# EasyEDA Pro project EasyEDA_sensor_project.epro

# Schematic Schematic1
Board Name: Board1; Create Date: 2025-11-02; Page Name: P1; Project Name: Sensor_Proyect; Schematic Name: Schematic1; Update Date: 2025-11-25; Company: EasyEDA.com; Page Size: A4; Version: V1.0
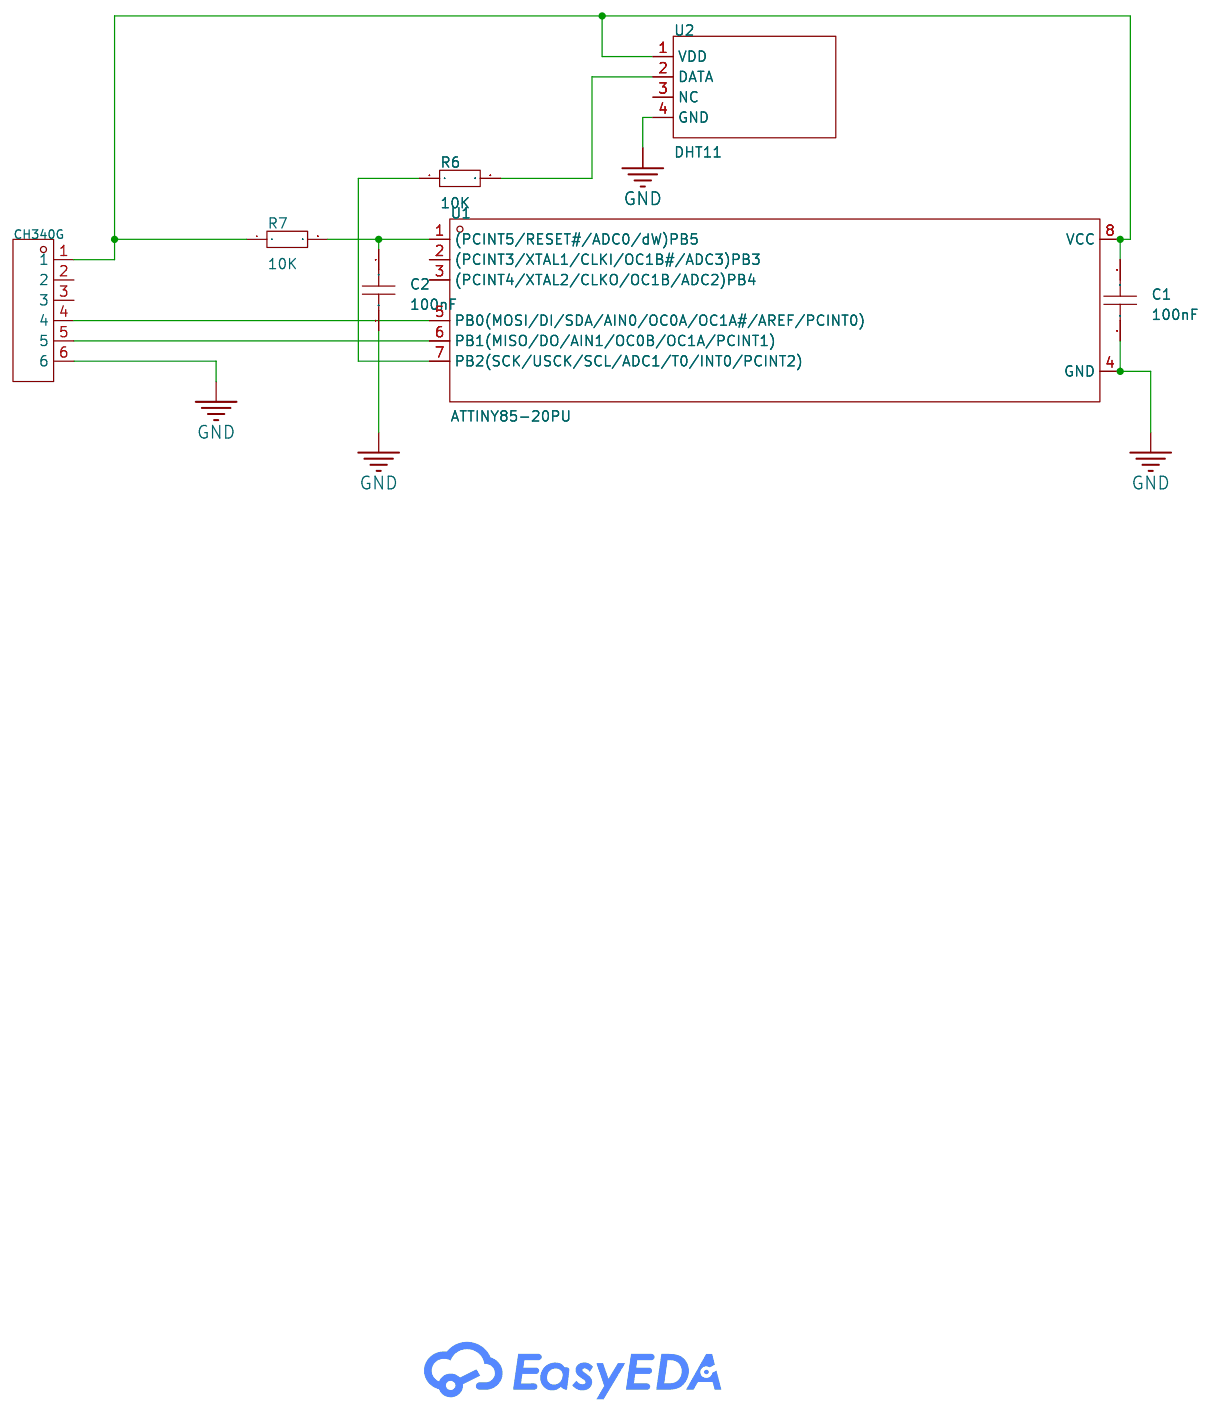
[diagram p0: schematic sheet]

## Parts
C1  100nF  [C0805]
C2  100nF  [C0805]
CH340G  -  [HDR-TH_6P-P2.54-V-F]
R6  10K  [RES-TH_BD1.6-L3.6-P7.60-D0.5]
R7  10K  [RES-TH_BD1.6-L3.6-P7.60-D0.5]
U1  ATTINY85-20PU  [PDIP-8_L9.3-W6.4-P2.54-LS7.9-BL-1]
U2  DHT11  [SENSOR-TH_DHT11]

## Library data of the parts
C1 C2 = CAP_0805: Supplier Footprint: 0805
CH340G = HDR-F_2.54_1x6P: Supplier Footprint: Through
R6 R7 = Res_0603: Supplier Footprint: 0603
U1 = ATTINY85-20PU: CPU Core:AVR CPU Maximum Speed:20MHz Program Storage Size:8KB Program Memory Type:FLASH EEPROM:512Byte Number of I/O:6 ADC (Bit):10bit Voltage - Supply:2.7V~5.5V Voltage - Supply:2.7V~5.5V Applications:-; Supplier Part: C965497; Manufacturer: MICROCHIP(美国微芯); Supplier Footprint: PDIP-8; JLCPCB Part Class: Extended Part; Datasheet: https://item.szlcsc.com/datasheet/ATTINY85-20PU/1052792.html; Supplier: LCSC; CPU Core: AVR; CPU Maximum Speed: 20MHz; Program Storage Size: 8KB; Program Memory Type: FLASH; EEPROM: 512Byte; Number of I/O: 6; ADC (Bit): 10bit; Voltage - Supply: 2.7V~5.5V
U2 = DHT11_C117051: LCSC Part Name: 新款电容式数字温湿度传感器,老款已停产16.1x12.6x5.8mm DHT11  电容式传感器; Supplier Part: C117051; Manufacturer: 广州奥松; Supplier Footprint: SIP-4; JLCPCB Part Class: Extended Part; Datasheet: https://atta.szlcsc.com/upload/public/pdf/source/20170703/1499081238365.pdf; Supplier: LCSC

## Nets
GND: C1.2 C2.2 CH340G.6 U1.4(GND) U2.4(GND)
$1N1851: R6.1 U1.7(PB2(SCK/USCK/SCL/ADC1/T0/INT0/PCINT2))
$1N1886: C2.1 R7.2 U1.1((PCINT5/RESET#/ADC0/dW)PB5)
$1N2650: CH340G.5 U1.6(PB1(MISO/DO/AIN1/OC0B/OC1A/PCINT1))
$1N2669: C1.1 CH340G.1 R7.1 U1.8(VCC) U2.1(VDD)
$1N2720: CH340G.4 U1.5(PB0(MOSI/DI/SDA/AIN0/OC0A/OC1A#/AREF/PCINT0))
$1N2765: R6.2 U2.2(DATA)

Not connected (* = marked no-connect by the designer): CH340G 2 3; U1 2((PCINT3/XTAL1/CLKI/OC1B#/ADC3)PB3) 3((PCINT4/XTAL2/CLKO/OC1B/ADC2)PB4); U2 3(NC)
